# Altium project EVB_r2-1.PrjPCB (part 2 of 2)

## Sheet uINS.SchDoc: uINS
size B; DocumentNumber: 3; SheetNumber: 3; SheetTotal: 11
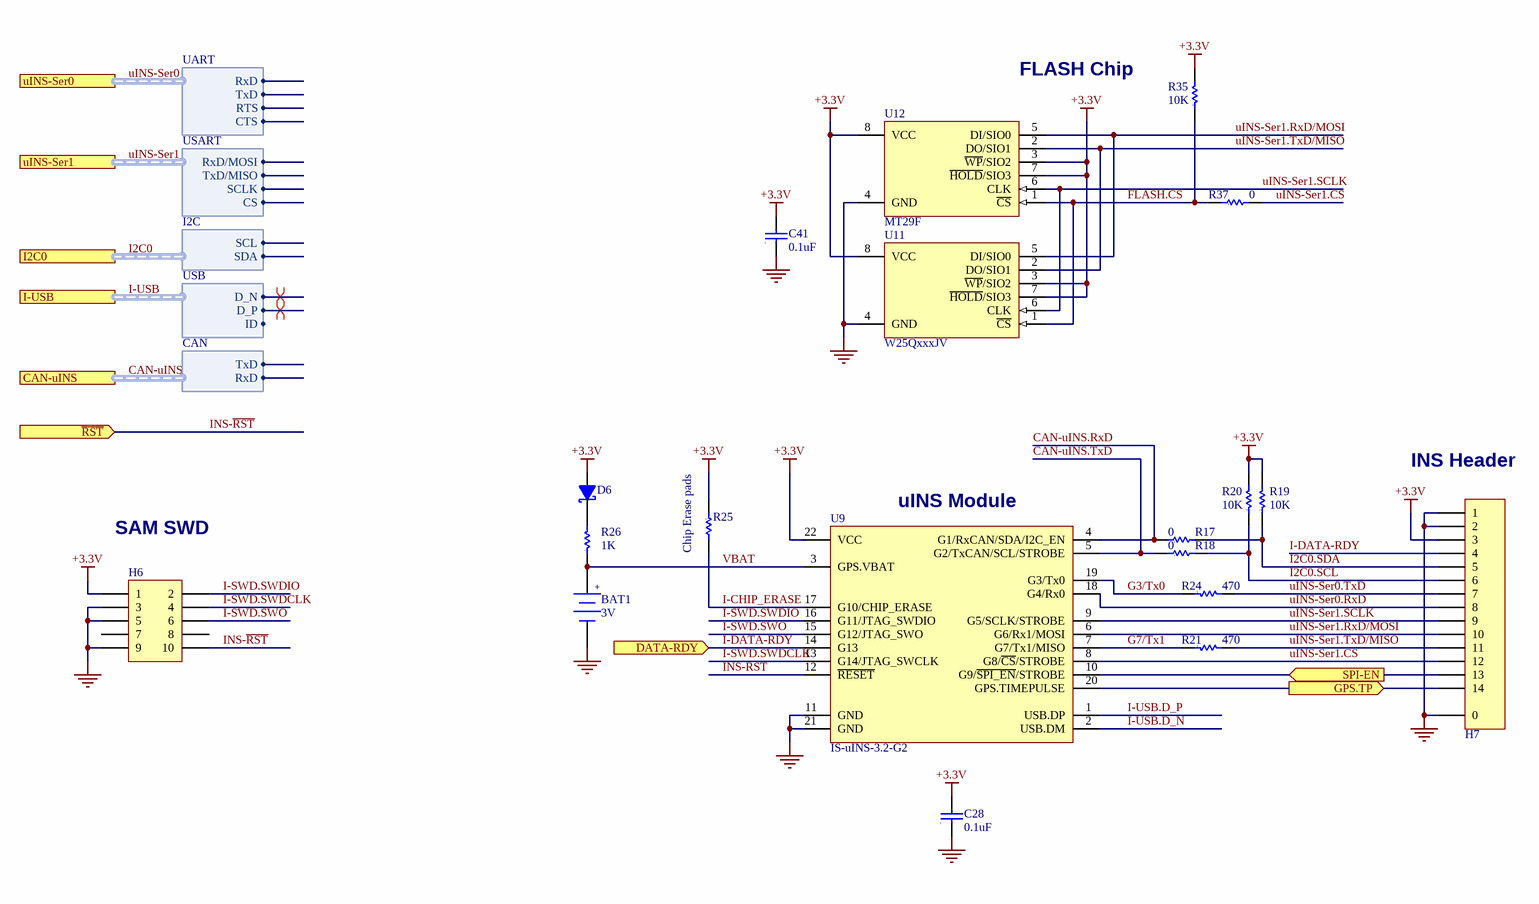
[diagram p3: uINS.SchDoc]

### Parts
BAT1  Voltage Rating: 3V  [ML614S]  (hidden comment: Battery)
C28  value 0.1uF  [0402]  (hidden comment: Cap)
C41  value 0.1uF  [0402]  (hidden comment: Cap)
D6  Diode - Schottky  [D0603B]  (value not drawn)
H6  Hdr - 5x2pin  [FTSH-105-01-L-DV-K-A-P]  (value not drawn)
H7  Hdr - 14pin - mount  [SM14B-GHS-TB(LF)(SN)]  (value not drawn)
R17  value 0  [R0402]  (hidden comment: Res)
R18  value 0  [R0402]  (hidden comment: Res)
R19  value 10K  [R0402]  (hidden comment: Res)
R20  value 10K  [R0402]  (hidden comment: Res)
R21  value 470  [R0402]  (hidden comment: Res)
R24  value 470  [R0402]  (hidden comment: Res)
R25  Res  [R0402]  (value not drawn)
R26  value 1K  [R0402]  (hidden comment: Res)
R35  value 10K  [R0402]  (hidden comment: Res)
R37  value 0  [R0402]  (hidden comment: Res)
U9  Manufacturer Part Number: IS-uINS-3.2-G2  [IS-uINS-3.2_no_paste]  (hidden comment: uINS)
U11  W25QxxxJV  [SOIC127P790X216-8N]
U12  MT29F  [DFN800X600X65-8N]

### Ports
CAN-uINS (harness CAN), DATA-RDY (in), GPS.TP (out), I2C0 (harness I2C), I-USB (harness USB), SPI-EN (in), uINS-Ser0 (harness UART), uINS-Ser1 (harness USART), ~{RST} (in)

### Harnesses
UART: RxD, TxD, RTS, CTS
USART: RxD/MOSI, TxD/MISO, CS, SCLK
I2C: SCL, SDA
USB: D_N, D_P, ID
CAN: TxD, RxD

### Nets
+3.3V: C28.2 C41.2 D6.A H6.1 H7.3 R19.2 R20.2 R25.1 R35.2 U9.22(VCC) U11.3(~{WP}/SIO2) U11.7(~{HOLD}/SIO3) U11.8(VCC) U12.3(~{WP}/SIO2) U12.7(~{HOLD}/SIO3) U12.8(VCC)
GND: BAT1.- C28.1 C41.1 H6.3 H6.5 H6.9 H7.0 H7.1 H7.2 U9.11(GND) U9.21(GND) U11.4(GND) U12.4(GND)
CAN-uINS.RxD: R17.1 U9.4(G1/RxCAN/SDA/I2C_EN)
CAN-uINS.TxD: R18.1 U9.5(G2/TxCAN/SCL/STROBE)
FLASH.CS: R35.1 R37.1 U11.1(~{CS}) U12.1(~{CS})
G3/Tx0: R24.1 U9.19(G3/Tx0)
G7/Tx1: R21.1 U9.7(G7/Tx1/MISO)
GPS.TIMEPULSE: H7.14 U9.20(GPS.TIMEPULSE) ; port GPS.TP
I2C0.SCL: H7.6 R18.2 R20.1
I2C0.SDA: H7.5 R17.2 R19.1
I-CHIP_ERASE: R25.2 U9.17(G10/CHIP_ERASE)
I-DATA-RDY: H7.4 U9.14(G13) ; port DATA-RDY
I-SWD.SWDCLK: H6.4 U9.13(G14/JTAG_SWCLK)
I-SWD.SWDIO: H6.2 U9.16(G11/JTAG_SWDIO)
I-SWD.SWO: H6.6 U9.15(G12/JTAG_SWO)
I-USB.D_N: U9.2(USB.DM)
I-USB.D_P: U9.1(USB.DP)
INS-~{RST}: H6.10 U9.12(~{RESET}) ; port ~{RST}
uINS-Ser0.RxD: H7.8 U9.18(G4/Rx0)
uINS-Ser0.TxD: H7.7 R24.2
uINS-Ser1.CS: H7.12 R37.2 U9.8(G8/~{CS}/STROBE)
uINS-Ser1.RxD/MOSI: H7.10 U9.6(G6/Rx1/MOSI) U11.5(DI/SIO0) U12.5(DI/SIO0)
uINS-Ser1.SCLK: H7.9 U9.9(G5/SCLK/STROBE) U11.6(CLK) U12.6(CLK)
uINS-Ser1.TxD/MISO: H7.11 R21.2 U11.2(DO/SIO1) U12.2(DO/SIO1)
uINS-SPI-EN: H7.13 U9.10(G9/~{SPI_EN}/STROBE) ; port SPI-EN
VBAT: BAT1.+ R26.1 U9.3(GPS.VBAT)
NetD6_C: D6.C R26.2

Not connected (* = marked no-connect by the designer): H6 7 8

### Buses and harness runs
harness CAN-uINS =  = port CAN-uINS
harness I2C0 = port I2C0
harness I-USB = port I-USB
harness uINS-Ser0 = port uINS-Ser0
harness uINS-Ser1 = port uINS-Ser1

### Layout directives
differential pair: I-USB.D_N, I-USB.D_P

### Notes on the sheet
- FLASH Chip
- (near H7) INS Header
- SAM SWD
- (near U9) uINS Module
- (near R25) Chip Erase pads
- Date
- Sheet
- Project
- Time
- PCB
- Assy
- of
- Size
- B
- File

### Library data of the parts
BAT1 = Battery: BATTERY LITH 3V RECHARGE SMD; Manufacturer 1: Seiko; Manufacturer Part Number 1: MS621T-FL11E; Description: BATTERY LITH 3V 3MAH COIN 6.8MM; Capacity: 3mAh; Supplier 1: Digi-Key; Supplier Part Number 1: 728-1080-ND; Stock 1: 1968; Pricing 1: 1=2.60000, 10=2.15200, 50=1.89740, 100=1.79140, 300=1.66420, 500=1.57940, 1000=1.49460, 2500=1.42040 (USD); RoHS: Yes; Weight: 0.23g; Termination: SMD/SMT; Height: 0.08inch; ComponentLink2URL: https://www.sii.co.jp/en/me/files/2018/04/MicroBattery_catalogue_E_2018_forWeb.pdf?src-supplier=Digi-Key; ComponentLink2Description: https://www.sii.co.jp/en/me/files/2018/04/MicroBattery_catalogue_E_2018_forWeb.pdf?src-supplier=Digi-Key
C28 C41 = Cap: CAP CER .10UF 50V X7R 10% 0402; Manufacturer: TDK Corporation; Manufacturer Part Number: C1005X7R1H104K; Capacitance: 0.1µF; Published: 8-Jun-2000; LatestRevisionDate: 17-Jul-2002; LatestRevisionNote: Re-released for DXP Platform.; Publisher: Altium Limited; Category: Capacitors; Supplier 1: Digi-Key; Supplier Part Number 1: 445-5932-1-ND; RoHS: RoHS Compliant; Stock 1: 174080; Pricing 1: 1=0.3, 10=0.2, 100=0.08, 250=0.05752, 500=0.041, 1000=0.03 (USD); Voltage - Rated: 50V; Tolerance: ±10%; Temperature Coefficient: X7R; Mounting Type: Surface Mount, MLCC; Operating Temperature: -55°C ~ 125°C; Applications: General Purpose; Ratings: -; Package / Case: 0402 (1005 Metric); Size / Dimension: 0.039" L x 0.020" W (1.00mm x 0.50mm); Height: -; Thickness: 0.022" (0.55mm); Lead Spacing: -; Features: -; Packaging: Cut Tape (CT); Lead Style: -; ComponentLink1URL: http://www.tdk.co.jp/tefe02/e412_c.pdf; ComponentLink1Description: http://www.tdk.co.jp/tefe02/e412_c.pdf
D6 = Diode - Schottky: DIODE SCHOTTKY 30V 2A 0603; Manufacturer: Vishay; Manufacturer Part Number: VSKY20301608-G4-08; Supplier 1: Digi-Key; Supplier Part Number 1: VSKY20301608-G4-08GICT-ND; Stock 1: 13064; Pricing 1: 1=0.38, 10=0.305, 25=0.2792, 100=0.2076, 250=0.1882, 500=0.15574, 1000=0.1168, 2500=0.10707 (USD); ComponentLink1URL: http://www.mouser.com/ds/2/427/vsky20301608-777242.pdf; ComponentLink1Description: http://www.mouser.com/ds/2/427/vsky20301608-777242.pdf
H6 = Hdr - 5x2pin: CONN HEADER 10POS DUAL .05" SMD; Manufacturer: Samtec; Number of Contacts: 10; Gender: Male; Pitch: 1.27mm; ComponentLink1URL: http://www.samtec.com/documents/webfiles/pdf/FTSH_SMT.pdf; ComponentLink1Description: http://www.samtec.com/documents/webfiles/pdf/FTSH_SMT.pdf; Supplier 1: Digi-Key; Supplier Part Number 1: SAM9440-ND; Manufacturer Part Number: FTSH-105-01-L-DV-K-A-P; Stock 1: 3679; Pricing 1: 1=4.15, 92=3.48598, 184=3.32, 552=2.82199, 1012=2.407 (USD); Contact Plating: Gold; Contact Material: Bronze; Housing Colour: Black; Housing Material: Polymer; Min Operating Temperature: -55°C; Max Operating Temperature: 125°C; Number of Rows: 2; Packaging: Bulk; Termination: Solder; Orientation: Straight; Length: 6.35mm; Depth: 3.43mm; Radiation Hardening: No; Lead Free: Lead Free
H7 = Hdr - 14pin - mount: CONN HEADER GH SIDE 14POS 1.25MM; Manufacturer: JST; Number of Positions: 14; Connector Type: Outer Shroud Contact; Current Rating: 1A; Voltage Rating (AC): 50V; Gender: Male; Pitch: 0.049inch; Wire/Cable Gauge: 26AWG; Supplier 1: Digi-Key; Supplier Part Number 1: 455-1576-6-ND; Manufacturer Part Number: SM14B-GHS-TB(LF)(SN); Stock 1: 0; Mount: Surface Mount; Contact Plating: Tin; Colour: Natural; Contact Material: Bronze; Housing Colour: Natural; Housing Material: Nylon; Min Operating Temperature: -25°C; Max Operating Temperature: 85°C; Number of Rows: 1; Packaging: Tape and Reel; Termination: Solder; Fastening Type: Ramp; Number of Contacts: 14; REACH SVHC: No SVHC; Lead Free: Lead Free
R17 R18 R37 = Res: RES SMD 0 OHM JUMPER 1/16W 0402; Manufacturer: Yageo; Manufacturer Part Number: RC0402JR-070RL; Resistor Case Style: 0402 [1005 Metric]; Resistance Tolerance: ± 5%; Resistor Element Type: Thick Film; SVHC: No SVHC (20-Jun-2016); Resistance: 0mR; Power Rating: 62.5mW; Tolerance: 5%; Voltage Rating: 50V; Max Power Dissipation: 63mW; Temperature Coefficient: 200ppm/°C; Product Range: -; Automotive Qualification Standard: -; MSL: MSL 1 - Unlimited; ComponentLink1URL: https://datasheet.ciiva.com/2452/pyu-rc0402-51-rohs-l-6-2452608.pdf; ComponentLink1Description: https://datasheet.ciiva.com/2452/pyu-rc0402-51-rohs-l-6-2452608.pdf; ComponentLink2URL: https://datasheet.ciiva.com/2452/pyu-r-int-thick-7-2452609.pdf; ComponentLink2Description: https://datasheet.ciiva.com/2452/pyu-r-int-thick-7-2452609.pdf; ComponentLink3URL: https://datasheet.ciiva.com/2452/pyu-r-int-thick-7-2452610.pdf; ComponentLink3Description: https://datasheet.ciiva.com/2452/pyu-r-int-thick-7-2452610.pdf; ComponentLink4URL: https://datasheet.ciiva.com/11808/0900766b80c66297-11808195.pdf; ComponentLink4Description: https://datasheet.ciiva.com/11808/0900766b80c66297-11808195.pdf; ComponentLink5URL: https://datasheet.ciiva.com/8896/pyu-rc0402-51-rohs-l-6-8896201.pdf; ComponentLink5Description: https://datasheet.ciiva.com/8896/pyu-rc0402-51-rohs-l-6-8896201.pdf; ComponentLink6URL: https://datasheet.ciiva.com/28386/pyu-rc0402-51-rohs-l-6-28386633.pdf; ComponentLink6Description: https://datasheet.ciiva.com/28386/pyu-rc0402-51-rohs-l-6-28386633.pdf; ComponentLink7URL: https://datasheet.ciiva.com/22747/1018594-22747515.pdf; ComponentLink7Description: https://datasheet.ciiva.com/22747/1018594-22747515.pdf; ComponentLink8URL: https://datasheet.ciiva.com/15189/getdatasheetpartid-326379-15189533.pdf; ComponentLink8Description: https://datasheet.ciiva.com/15189/getdatasheetpartid-326379-15189533.pdf; ComponentLink9URL: https://datasheet.ciiva.com/7983/1018594-7983535.pdf; ComponentLink9Description: https://datasheet.ciiva.com/7983/1018594-7983535.pdf; Supplier 1: Digi-Key; Supplier Part Number 1: 311-0.0JRDKR-ND; Stock 1: 39749506; Pricing 1: 1=0.1, 10=0.017, 25=0.0124, 50=0.0096, 100=0.007, 250=0.00536, 500=0.00428, 1000=0.00315, 5000=0.00226 (USD); Case/Package: 0402; Contact Plating: Matte,Tin; Case Code (Metric): 1005; Case Code (Imperial): 0402; Min Operating Temperature: -55°C; Max Operating Temperature: 155°C; Composition: Thick Film; Packaging: Tape and Reel; Package Quantity: 1; Number of Terminations: 2; Termination: SMD/SMT; Military Standard: Not; Features: Moisture Resistant; Length: 1mm; Height: 0.016inch; Width: 0.02inch; Depth: 0.5mm; Radiation Hardening: No; REACH SVHC: Unknown; Lead Free: Lead Free
R19 R20 R35 = Res: RES 10K OHM 1/16W 1% 0402 SMD; Manufacturer: Panasonic; Manufacturer Part Number: ERJ-2RKF1002X; Resistance: 10kR; Voltage Rating (DC): 50V; Power Rating: 62.5mW; Temperature Coefficient: 100ppm/°C; Max Power Dissipation: 100mW; LatestRevisionDate: 2-Dec-2009; ComponentLink1URL: http://www.yageo.com/documents/recent/PYu-RC0402_51_RoHS_L_6.pdf; ComponentLink1Description: http://www.yageo.com/documents/recent/PYu-RC0402_51_RoHS_L_6.pdf; Supplier 2: Digi-Key; Supplier Part Number 2: 311-10.0KLRDKR-ND; Stock 2: 0; Pricing 2: 1=0.1, 10=0.018, 100=0.0073, 1000=0.00329, 2500=0.00286, 5000=0.00236 (USD); Case/Package: 0402; Number of Pins: 2; Case Code (Imperial): 0402; Case Code (Metric): 1005; Min Operating Temperature: -55°C; Max Operating Temperature: 155°C; Voltage Rating: 50V; Termination: SMD/SMT; Military Standard: Not; Working Voltage: 50V; Length: 1mm; Width: 0.5mm; Depth: 0.5mm; Lead Pitch: 0.2mm; REACH SVHC: No SVHC; Lead Free: Lead Free; ComponentLink2URL: https://datasheet.ciiva.com/7660/38568-7660787.pdf; ComponentLink2Description: https://datasheet.ciiva.com/7660/38568-7660787.pdf; ComponentLink3URL: https://datasheet.ciiva.com/11808/0900766b80c66297-11808309.pdf; ComponentLink3Description: https://datasheet.ciiva.com/11808/0900766b80c66297-11808309.pdf; ComponentLink4URL: https://datasheet.ciiva.com/7849/1784430-7849813.pdf; ComponentLink4Description: https://datasheet.ciiva.com/7849/1784430-7849813.pdf; ComponentLink5URL: https://datasheet.ciiva.com/16744/pyu-rc0402-51-rohs-l-6-r-16744005.pdf; ComponentLink5Description: https://datasheet.ciiva.com/16744/pyu-rc0402-51-rohs-l-6-r-16744005.pdf; ComponentLink6URL: https://datasheet.ciiva.com/7849/1686128-7849814.pdf; ComponentLink6Description: https://datasheet.ciiva.com/7849/1686128-7849814.pdf; ComponentLink7URL: https://datasheet.ciiva.com/7849/1784430-7849815.pdf; ComponentLink7Description: https://datasheet.ciiva.com/7849/1784430-7849815.pdf; ComponentLink8URL: https://datasheet.ciiva.com/22747/1018594-22747512.pdf; ComponentLink8Description: https://datasheet.ciiva.com/22747/1018594-22747512.pdf; ComponentLink9URL: https://datasheet.ciiva.com/12667/pyu-rc0402-51-rohs-l-6-r-12667067.pdf; ComponentLink9Description: https://datasheet.ciiva.com/12667/pyu-rc0402-51-rohs-l-6-r-12667067.pdf; ComponentLink10URL: https://datasheet.ciiva.com/7983/1018594-7983486.pdf; ComponentLink10Description: https://datasheet.ciiva.com/7983/1018594-7983486.pdf; Supplier 1: Digi-Key; Supplier Part Number 1: P10.0KLDKR-ND; Stock 1: 28312782; Pricing 1: 1=0.1, 10=0.045, 100=0.0184, 1000=0.00826, 2500=0.00717, 5000=0.00593 (USD); Mount: Surface Mount; Contact Plating: Tin; Tolerance: 1%; Composition: Thick Film; Packaging: Tape and Reel; Package Quantity: 1; Number of Terminations: 2; Features: Automotive AEC-Q200; Height: 0.35mm; Radiation Hardening: No
R21 R24 = Res: RES 470 OHM 1/16W 1% 0402 SMD; Manufacturer: Vishay Dale; Manufacturer Part Number: CRCW0402470RFKED; Power (Watts): 0.063W, 1/16W; Temperature Coefficient: ±100ppm/°C; Supplier 1: Digi-Key; Supplier Part Number 1: 541-470LCT-ND; RoHS: RoHS Compliant; Category: Resistors; Stock 1: 121698; Pricing 1: 10=0.083, 50=0.0444, 200=0.0255, 1000=0.0174 (USD); Packaging: Cut Tape (CT); Resistance (Ohms): 470; Tolerance: ±1%; Composition: Thick Film; Features: Automotive AEC-Q200 Qualified; Package / Case: 0402 (1005 Metric); Supplier Device Package: 0402 (1005 Metric); Size / Dimension: 0.039" L x 0.020" W (1.00mm x 0.50mm); Height: 0.016" (0.40mm); Number of Terminations: 2; ComponentLink1URL: http://www.vishay.com/doc?20035; ComponentLink1Description: http://www.vishay.com/doc?20035
R25 = Res: RES SMD 0402 NO LOAD; Value: NO LOAD; ComponentLink2URL: https://datasheet.ciiva.com/46394/1018594-46394951.pdf?src-supplier=Element14; ComponentLink2Description: https://datasheet.ciiva.com/46394/1018594-46394951.pdf?src-supplier=Element14; ComponentLink3URL: https://datasheet.ciiva.com/16741/pyu-rc0402-51-rohs-l-6-r-16741081.pdf?src-supplier=Future+Electronics; ComponentLink3Description: https://datasheet.ciiva.com/16741/pyu-rc0402-51-rohs-l-6-r-16741081.pdf?src-supplier=Future+Electronics; ComponentLink4URL: https://datasheet.ciiva.com/7849/1018594-7849882.pdf?src-supplier=Element14; ComponentLink4Description: https://datasheet.ciiva.com/7849/1018594-7849882.pdf?src-supplier=Element14; ComponentLink5URL: https://datasheet.ciiva.com/7849/1018594-7849883.pdf?src-supplier=Element14; ComponentLink5Description: https://datasheet.ciiva.com/7849/1018594-7849883.pdf?src-supplier=Element14
R26 = Res: RES 1.00K OHM 1/16W 1% 0402 SMD; Manufacturer: Yageo; Manufacturer Part Number: RC0402FR-071KL; Power (Watts): 0.063W, 1/16W; Temperature Coefficient: ±100ppm/°C; LatestRevisionDate: 2-Dec-2009; Supplier 1: Digi-Key; Supplier Part Number 1: 311-1.00KLRCT-ND; RoHS: RoHS Compliant; Category: Resistors; Stock 1: 3222170; Pricing 1: 1=0.1, 10=0.014, 100=0.0063, 500=0.00382, 1000=0.0027, 5000=0.00203 (USD); Resistance (Ohms): 1k; Composition: Thick Film; Features: -; Tolerance: ±1%; Package / Case: 0402 (1005 Metric); Size / Dimension: 0.039" L x 0.020" W (1.00mm x 0.50mm); Height: 0.016" (0.40mm); Number of Terminations: 2; Packaging: Cut Tape (CT); ComponentLink1URL: http://www.yageo.com/documents/recent/PYu-RC0402_51_RoHS_L_6.pdf; ComponentLink1Description: http://www.yageo.com/documents/recent/PYu-RC0402_51_RoHS_L_6.pdf
U9 = IS-uINS-3.2: Inertial Sense uINS; Manufacturer: Inertial Sense; Supplier 1: Inertial Sense; Supplier Part Number 1: IS-uINS-3.2-G1
U11 = W25Q128JV: IC FLASH 128M SPI 133MHZ 8SOIC; Manufacturer: Winbond; Manufacturer Part Number: W25Q128JVSIQTR; Memory Type: FLASH,NOR; Frequency: 104MHz; Interface: Serial,SPI; Supplier 1: Digi-Key; Supplier Part Number 1: W25Q128JVSIQCT-ND; Stock 1: 88262; Pricing 1: 1=2.2, 10=2.006, 25=1.9528, 50=1.9424, 100=1.7362, 250=1.73108, 500=1.70532, 750=1.67955, 1000=1.63215 (USD); Case/Package: SOIC; Min Operating Temperature: -40°C; Max Operating Temperature: 85°C; Packaging: Tape and Reel
U12 = MT29F: IC FLASH 1G/2G SPI 8UPDFN; Manufacturer: Micron Technology; Manufacturer Part Number: MT29F2G01ABAGDWB-IT:GTR; Memory Type: FLASH,NAND; Interface: Serial,SPI; Supplier 1: Digi-Key; Supplier Part Number 1: 557-1664-6-ND; Stock 1: 7067; Pricing 1: 1=5.24, 10=4.756, 25=4.6528, 50=4.627, 100=4.1496, 250=4.13412, 500=3.98186, 1000=3.78574 (USD); Min Operating Temperature: -40°C; Max Operating Temperature: 85°C

## Sheet Xbee.SchDoc: XBee Radio
size A; DocumentNumber: 4; SheetNumber: 4; SheetTotal: 11
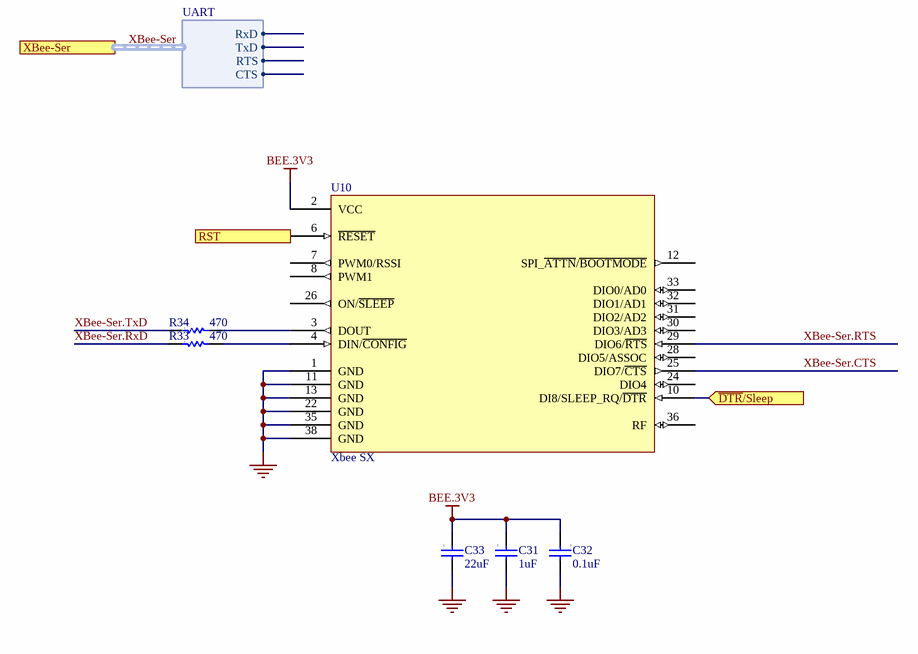
[diagram p4: Xbee.SchDoc]

### Parts
C31  value 1uF  [0603]  (hidden comment: Cap)
C32  value 0.1uF  [0402]  (hidden comment: Cap)
C33  value 22uF  [1206]  (hidden comment: Cap)
R33  value 470  [R0402]  (hidden comment: Res)
R34  value 470  [R0402]  (hidden comment: Res)
U10  Xbee SX  [XBP9X-DMUS-001]

### Ports
RST (in), XBee-Ser (harness UART), ~{DTR}/Sleep (in)

### Harnesses
UART: RxD, TxD, CTS, RTS

### Nets
BEE.3V3: C31.1 C32.1 C33.1 U10.2(VCC)
GND: C31.2 C32.2 C33.2 U10.1(GND) U10.11(GND) U10.13(GND) U10.22(GND) U10.35(GND) U10.38(GND)
XBee-DTR: U10.10(DI8/SLEEP_RQ/~{DTR}) ; port ~{DTR}/Sleep
XBee-RST: U10.6(~{RESET}) ; port RST
XBee-Ser.CTS: U10.25(DIO7/~{CTS})
XBee-Ser.RTS: U10.29(DIO6/~{RTS})
XBee-Ser.RxD: R33.1
XBee-Ser.TxD: R34.1
NetR33_2: R33.2 U10.4(DIN/~{CONFIG})
NetR34_2: R34.2 U10.3(DOUT)

Not connected (* = marked no-connect by the designer): U10 7(PWM0/RSSI) 8(PWM1) 12(SPI_~{ATTN}/~{BOOTMODE}) 24(DIO4) 26(ON/~{SLEEP}) 28(DIO5/ASSOC) 30(DIO3/AD3) 31(DIO2/AD2) 32(DIO1/AD1) 33(DIO0/AD0) 36(RF)

### Buses and harness runs
harness XBee-Ser = port XBee-Ser

### Notes on the sheet
- Date
- Sheet
- Project
- Time
- PCB
- Assy
- of
- Size
- A
- File

### Library data of the parts
C31 = Cap: CAP CER 1UF 25V X7R 0603; Manufacturer: Samsung; Manufacturer Part Number: CL10B105KA8NNNC; Tolerance: 10%; Published: 8-Jun-2000; LatestRevisionDate: 17-Jul-2002; LatestRevisionNote: Re-released for DXP Platform.; Publisher: Altium Limited; Category: Capacitors; Supplier 1: Digi-Key; Supplier Part Number 1: 1276-1184-6-ND; Stock 1: 0; Pricing 1: 1=0.1, 10=0.069, 100=0.0306, 500=0.02188, 1000=0.01719 (USD); Mount: Surface Mount; Case/Package: 0603; Case Code (Metric): 1608; Case Code (Imperial): 0603; Contact Plating: Tin; Min Operating Temperature: -55°C; Max Operating Temperature: 125°C; Capacitance: 1uF; Dielectric: X7R; Packaging: Tape and Reel; Voltage Rating: 25V; Package Quantity: 1; Voltage: 25V; Length: 1.6mm; Height: 0.8mm; Width: 0.031inch; Thickness: 0.035inch; Depth: 0.8mm; Radiation Hardening: No; ComponentLink1URL: https://datasheet.ciiva.com/16449/cl10b105ka8nnnc-16449544.pdf; ComponentLink1Description: https://datasheet.ciiva.com/16449/cl10b105ka8nnnc-16449544.pdf; ComponentLink2URL: https://datasheet.ciiva.com/15195/getdatasheetpartid-359554-15195726.pdf; ComponentLink2Description: https://datasheet.ciiva.com/15195/getdatasheetpartid-359554-15195726.pdf
C32 = Cap: as C28 on sheet uINS; Published: 8-Jun-2000; LatestRevisionDate: 17-Jul-2002; LatestRevisionNote: Re-released for DXP Platform.; Publisher: Altium Limited; Category: Capacitors; Supplier 1: Digi-Key; Supplier Part Number 1: 445-5932-1-ND; RoHS: RoHS Compliant; Stock 1: 174080; Pricing 1: 1=0.3, 10=0.2, 100=0.08, 250=0.05752, 500=0.041, 1000=0.03 (USD); Voltage - Rated: 50V; Tolerance: ±10%; Temperature Coefficient: X7R; Mounting Type: Surface Mount, MLCC; Operating Temperature: -55°C ~ 125°C; Applications: General Purpose; Ratings: -; Package / Case: 0402 (1005 Metric); Size / Dimension: 0.039" L x 0.020" W (1.00mm x 0.50mm); Height: -; Thickness: 0.022" (0.55mm); Lead Spacing: -; Features: -; Packaging: Cut Tape (CT); Lead Style: -; ComponentLink1URL: http://www.tdk.co.jp/tefe02/e412_c.pdf; ComponentLink1Description: http://www.tdk.co.jp/tefe02/e412_c.pdf
C33 = Cap: CAP CER 22UF 10V X5R 1206; Manufacturer: Samsung; Manufacturer Part Number: CL31A226KPHNNNE; Tolerance: 10%; ComponentLink1URL: http://www.murata.com/~/media/webrenewal/products/inductor/chip/tokoproducts/wirewoundmetalalloychiptype/m_dfe252012f.ashx; ComponentLink1Description: http://www.murata.com/~/media/webrenewal/products/inductor/chip/tokoproducts/wirewoundmetalalloychiptype/m_dfe252012f.ashx; ComponentLink2URL: https://www.murata.com/~/media/webrenewal/products/inductor/chip/tokoproducts/wirewoundmetalalloychiptype/m_dfe252012f.ashx; ComponentLink2Description: https://www.murata.com/~/media/webrenewal/products/inductor/chip/tokoproducts/wirewoundmetalalloychiptype/m_dfe252012f.ashx; Supplier 1: Digi-Key; Supplier Part Number 1: 1276-1287-6-ND; Stock 1: 46; Pricing 1: 1=0.42, 10=0.289, 100=0.1638, 500=0.1156, 1000=0.10114 (USD); Mount: Surface Mount; Case/Package: 1206; Case Code (Metric): 3216; Case Code (Imperial): 1206; Min Operating Temperature: -55°C; Max Operating Temperature: 85°C; Packaging: Tape and Reel; Package Quantity: 1; Capacitance: 22uF; Voltage Rating: 10V; Dielectric: X5R; Voltage Rating (DC): 10V; Length: 3.2mm; Height: 1.6mm; Width: 0.063inch; Thickness: 0.071inch; Depth: 1.6mm; Radiation Hardening: No; Lead Free: Lead Free; ComponentLink3URL: https://datasheet.ciiva.com/15196/getdatasheetpartid-355211-15196000.pdf; ComponentLink3Description: https://datasheet.ciiva.com/15196/getdatasheetpartid-355211-15196000.pdf; ComponentLink4URL: https://datasheet.ciiva.com/16437/cl05b104kq5nnnc-16437214.pdf; ComponentLink4Description: https://datasheet.ciiva.com/16437/cl05b104kq5nnnc-16437214.pdf
R33 R34 = Res: as R21 on sheet uINS; Supplier 1: Digi-Key; Supplier Part Number 1: 541-470LCT-ND; RoHS: RoHS Compliant; Category: Resistors; Stock 1: 121698; Pricing 1: 10=0.083, 50=0.0444, 200=0.0255, 1000=0.0174 (USD); Packaging: Cut Tape (CT); Resistance (Ohms): 470; Tolerance: ±1%; Composition: Thick Film; Features: Automotive AEC-Q200 Qualified; Package / Case: 0402 (1005 Metric); Supplier Device Package: 0402 (1005 Metric); Size / Dimension: 0.039" L x 0.020" W (1.00mm x 0.50mm); Height: 0.016" (0.40mm); Number of Terminations: 2; ComponentLink1URL: http://www.vishay.com/doc?20035; ComponentLink1Description: http://www.vishay.com/doc?20035
U10 = Xbee SX: XBEE PRO MOD TXRX ISM 915MHZ UFL; Manufacturer: Digi International; Frequency: 928MHz; Data Rate: 250Kbps; Sensitivity: -113dBm; Current - Receiving: 40mA; Current - Transmitting: 55mA; Supplier 1: Digi-Key; Supplier Part Number 1: 602-1890-ND; Manufacturer Part Number: XBP9X-DMUS-001; Stock 1: 681; Pricing 1: 1=99, 100=89.0003 (USD); Mount: Surface Mount; Case/Package: Module; Min Operating Temperature: -40°C; Max Operating Temperature: 85°C; Packaging: Tray; Lead Free: Lead Free

## Sheet CON-USB.SchDoc: USB Host
size A; DocumentNumber: 11; SheetNumber: 11; SheetTotal: 11
Used 2 times, as channels M, I. Parts and nets are listed once, with the designators drawn on the sheet.
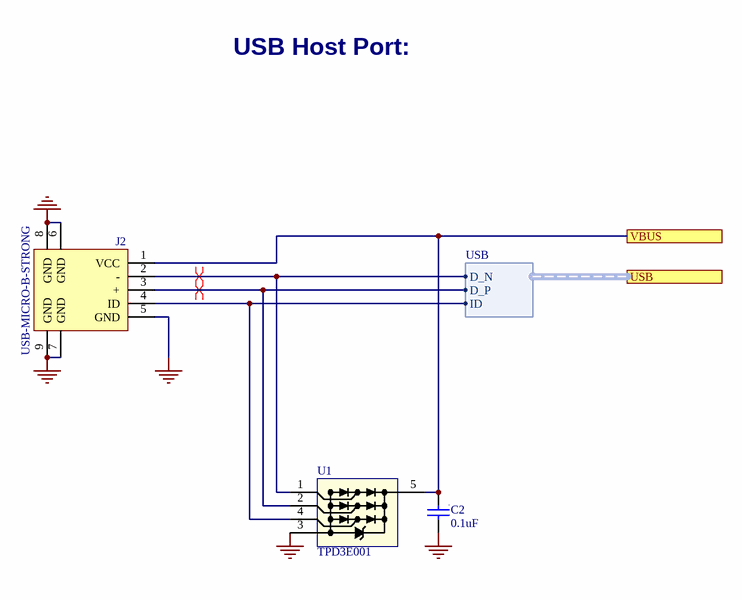
[diagram p5: CON-USB.SchDoc]

### Parts
C2  value 0.1uF  [0402]  (hidden comment: Cap)
J2  USB-MICRO-B-STRONG  [USB Micro AB R/A THR - design]
U1  TPD3E001  [SOTFL50P160X60-5N]

### Ports
USB (harness USB), VBUS

### Harnesses
USB: D_N, D_P, ID

### Nets
GND: C2.2 J2.5(GND) J2.6(GND) J2.7(GND) J2.8(GND) J2.9(GND) U1.3
VBUS: C2.1 J2.1(VCC) U1.5(nc) ; port VBUS
NetJ2_2: J2.2(-) U1.1 ; port USB.D_N
NetJ2_3: J2.3(+) U1.2 ; port USB.D_P
NetJ2_4: J2.4(ID) U1.4(nc) ; port USB.ID

### Channels
M: designators end in _M; ports VBUS=M-VUSB
I: designators end in _I; ports VBUS=I-VUSB

### Layout directives
differential pair; differential pair class USB: M-USB.D_N, M-USB.D_P

### Notes on the sheet
- USB Host Port:
- Date
- Sheet
- Project
- Time
- PCB
- Assy
- of
- Size
- A
- File

### Library data of the parts
C2 = Cap: as C28 on sheet uINS; Published: 8-Jun-2000; LatestRevisionDate: 17-Jul-2002; LatestRevisionNote: Re-released for DXP Platform.; Publisher: Altium Limited; Category: Capacitors; Supplier 1: Digi-Key; Supplier Part Number 1: 445-5932-1-ND; RoHS: RoHS Compliant; Stock 1: 174080; Pricing 1: 1=0.3, 10=0.2, 100=0.08, 250=0.05752, 500=0.041, 1000=0.03 (USD); Voltage - Rated: 50V; Tolerance: ±10%; Temperature Coefficient: X7R; Mounting Type: Surface Mount, MLCC; Operating Temperature: -55°C ~ 125°C; Applications: General Purpose; Ratings: -; Package / Case: 0402 (1005 Metric); Size / Dimension: 0.039" L x 0.020" W (1.00mm x 0.50mm); Height: -; Thickness: 0.022" (0.55mm); Lead Spacing: -; Features: -; Packaging: Cut Tape (CT); Lead Style: -; ComponentLink1URL: http://www.tdk.co.jp/tefe02/e412_c.pdf; ComponentLink1Description: http://www.tdk.co.jp/tefe02/e412_c.pdf
J2 = USB-TYPEAB-4GND: CONN USB MICRO B RECPT SMT R/A; Manufacturer: Amphenol FCI; Manufacturer Part Number: 10118194-0001LF; Gender: Receptacle; Current Rating: 1.8A; Connector Type: USB,Receptacle; Number of Contacts: 5; Insulation Resistance: 1GR; Number of Ports: 1; Max Voltage Rating (AC): 100V; Pitch: 0.65mm; ComponentLink1URL: https://datasheet.ciiva.com/851/10118194-851110.pdf; ComponentLink1Description: https://datasheet.ciiva.com/851/10118194-851110.pdf; ComponentLink2URL: https://datasheet.ciiva.com/851/10118194-851111.pdf; ComponentLink2Description: https://datasheet.ciiva.com/851/10118194-851111.pdf; ComponentLink3URL: https://datasheet.ciiva.com/4598/10118194ac-197217-4598807.pdf; ComponentLink3Description: https://datasheet.ciiva.com/4598/10118194ac-197217-4598807.pdf; ComponentLink4URL: https://datasheet.ciiva.com/29907/10118194-29907230.pdf; ComponentLink4Description: https://datasheet.ciiva.com/29907/10118194-29907230.pdf; ComponentLink5URL: https://datasheet.ciiva.com/26945/getdatasheetpartid-418619-26945695.pdf; ComponentLink5Description: https://datasheet.ciiva.com/26945/getdatasheetpartid-418619-26945695.pdf; Supplier 1: Digi-Key; Supplier Part Number 1: 609-4618-6-ND; Stock 1: 178809; Pricing 1: 1=0.5, 10=0.464, 25=0.418, 50=0.3716, 100=0.3561, 250=0.32516, 500=0.30966 (USD); Mount: Surface Mount,Horizontal; Colour: Black; Contact Material: Copper Alloy; Contact Plating: Gold; Number of Terminals: 5; Housing Material: Polymer; Min Operating Temperature: -55°C; Max Operating Temperature: 85°C; Package Quantity: 9600; Packaging: Tape and Reel; Termination: Solder; Orientation: Right Angle; Features: Shielded; Length: 8.05mm; Depth: 5mm; Radiation Hardening: No; Lead Free: Lead Free; Flammability Rating: UL94 V-0
U1 = TPD3E001: TVS DIODE 5.5V SOT5; Manufacturer: Texas Instruments; Manufacturer Part Number: TPD3E001DRLR; Direction: Unidirectional; Number of Channels: 3; Min Supply Voltage: 900mV; Capacitance: 1.5pF; Min Breakdown Voltage: 11V; Peak Pulse Power: 90W; Power Line Protection: Yes; Clamping Voltage: 105.5V; Leakage Current: 1nA; Max Supply Current: 100nA; Interface: USB; Supplier 1: Digi-Key; Supplier Part Number 1: 296-21885-1-ND; Stock 1: 81393; Pricing 1: 1=0.53, 10=0.454, 100=0.3392, 500=0.26648, 1000=0.20592 (USD); Case/Package: SOT; Number of Pins: 5; Weight: 9.9E-05oz; Min Operating Temperature: -40°C; Max Operating Temperature: 85°C; Max Supply Voltage: 5.5V; Packaging: Tape and Reel; Max Supply Voltage (DC): 5.5V; Min Supply Voltage (DC): 900mV; Package Quantity: 1; Number of Bidirectional Channels: 3; Reverse Standoff Voltage: 5.5V; Breakdown Voltage: 11V; Termination: SMD/SMT; Nominal Supply Current: 1nA; Length: 1.6mm; Height: 0.55mm; Width: 1.2mm; Depth: 1.2mm; Radiation Hardening: No; REACH SVHC: No SVHC; Lead Free: Lead Free

## Nets that join several sheets
+3.3V: CAN (C14.2 H2.2 U5.3), SAM70 (32 pins), uINS (16 pins)
BEE.3V3: SAM70 (H4.4 H4.5 H4.6), Xbee (C31.1 C32.1 C33.1 U10.2)
GND: Main (MP1.1 MP2.1 MP3.1 MP4.1), CAN (C14.1 H2.0 H2.1 U5.2), SAM70 (56 pins), uINS (13 pins), Xbee (9 pins), M (7 pins), I (7 pins)
GPS.TIMEPULSE: SAM70 (U3.F1), uINS (H7.14 U9.20)
I-DATA-RDY: SAM70 (U3.A5), uINS (H7.4 U9.14)
INS-~{RST}: SAM70 (C53.1 R54.1 U3.E12), uINS (H6.10 U9.12)
uINS-SPI-EN: SAM70 (U3.A9), uINS (H7.13 U9.10)
XBee-DTR: SAM70 (U3.B5), Xbee (U10.10)
XBee-RST: SAM70 (U3.A6), Xbee (U10.6)

## Assembly variants
IS-EVB-r2.1.0-G2-R: not fitted H6 R3 R15 R16 R17 R18 R25 R25 R27 R37 R47 R50 R53 R53 U11 U12
IS-EVB-r2.1.0-G2: not fitted H6 R3 R15 R16 R17 R18 R25 R25 R27 R37 R47 R50 R53 R53 U10 U11 U12